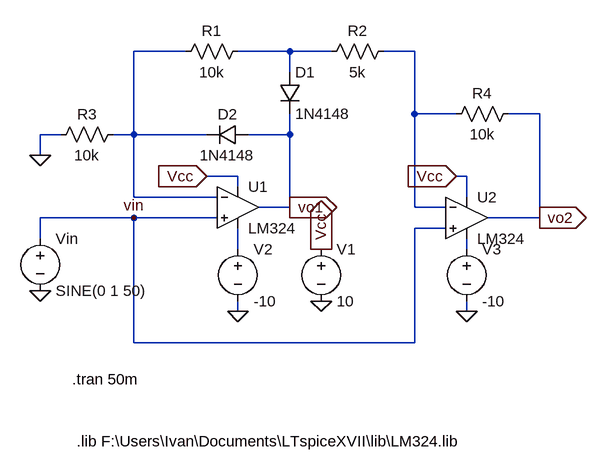
[diagram p0: schematic TP1_MORALES_SUAREZ_TORRES_C3.asc]
TP1_MORALES_SUAREZ_TORRES_C3.asc, the LTspice schematic file:
Version 4
SHEET 1 880 696
WIRE 160 80 80 80
WIRE 320 80 240 80
WIRE 384 80 320 80
WIRE 512 80 464 80
WIRE 320 112 320 80
WIRE 512 176 512 80
WIRE 576 176 512 176
WIRE 704 176 656 176
WIRE -32 208 -64 208
WIRE 80 208 80 80
WIRE 80 208 48 208
WIRE 192 208 80 208
WIRE 320 208 320 176
WIRE 320 208 256 208
WIRE -64 240 -64 208
WIRE 240 272 192 272
WIRE 592 272 576 272
WIRE 240 288 240 272
WIRE 80 304 80 208
WIRE 208 304 80 304
WIRE 592 304 592 272
WIRE 320 320 320 208
WIRE 320 320 272 320
WIRE 512 320 512 176
WIRE 560 320 512 320
WIRE 80 336 -64 336
WIRE 208 336 80 336
WIRE 704 336 704 176
WIRE 704 336 624 336
WIRE 560 352 512 352
WIRE -64 368 -64 336
WIRE 240 384 240 352
WIRE 592 384 592 368
WIRE 240 480 240 464
WIRE 592 480 592 464
WIRE 80 528 80 336
WIRE 512 528 512 352
WIRE 512 528 80 528
FLAG 240 480 0
FLAG 368 464 0
FLAG -64 240 0
FLAG 368 384 Vcc
IOPIN 368 384 Out
FLAG 192 272 Vcc
IOPIN 192 272 In
FLAG -64 448 0
FLAG 576 272 Vcc
IOPIN 576 272 In
FLAG 592 480 0
FLAG 704 336 vo2
IOPIN 704 336 Out
FLAG 80 336 vin
FLAG 320 320 vo1
IOPIN 320 320 Out
SYMBOL res 256 64 R90
WINDOW 0 0 56 VBottom 2
WINDOW 3 32 56 VTop 2
SYMATTR InstName R1
SYMATTR Value 10k
SYMBOL res 480 64 R90
WINDOW 0 0 56 VBottom 2
WINDOW 3 32 56 VTop 2
SYMATTR InstName R2
SYMATTR Value 5k
SYMBOL res 64 192 R90
WINDOW 0 0 56 VBottom 2
WINDOW 3 32 56 VTop 2
SYMATTR InstName R3
SYMATTR Value 10k
SYMBOL res 672 160 R90
WINDOW 0 0 56 VBottom 2
WINDOW 3 32 56 VTop 2
SYMATTR InstName R4
SYMATTR Value 10k
SYMBOL voltage 368 368 R0
WINDOW 123 0 0 Left 0
WINDOW 39 0 0 Left 0
SYMATTR InstName V1
SYMATTR Value 10
SYMBOL voltage 240 368 R0
WINDOW 123 0 0 Left 0
WINDOW 39 0 0 Left 0
SYMATTR InstName V2
SYMATTR Value -10
SYMBOL OpAmps\\LM324 240 320 R0
SYMATTR InstName U1
SYMBOL OpAmps\\LM324 592 336 R0
SYMATTR InstName U2
SYMBOL diode 304 112 R0
SYMATTR InstName D1
SYMATTR Value 1N4148
SYMBOL diode 256 192 R90
WINDOW 0 0 32 VBottom 2
WINDOW 3 32 32 VTop 2
SYMATTR InstName D2
SYMATTR Value 1N4148
SYMBOL voltage -64 352 R0
WINDOW 123 0 0 Left 0
WINDOW 39 0 0 Left 0
SYMATTR InstName Vin
SYMATTR Value SINE(0 1 50)
SYMBOL voltage 592 368 R0
WINDOW 123 0 0 Left 0
WINDOW 39 0 0 Left 0
SYMATTR InstName V3
SYMATTR Value -10
TEXT -8 680 Left 2 !.lib F:\\Users\\Ivan\\Documents\\LTspiceXVII\\lib\\LM324.lib
TEXT 88 584 Right 2 !.tran 50m

The netlist it stands for:
* TP1_MORALES_SUAREZ_TORRES_C3.asc
R1 N002 N001 10k
R2 N003 N002 5k
R3 N001 0 10k
R4 vo2 N003 10k
V1 Vcc 0 10
V2 N004 0 -10
* U1: LM324 (symbol OpAmps\LM324 not available, pins judged from their places): In+=vin In-=N001 V+=Vcc V-=N004 OUT=vo1
* U2: LM324 (symbol OpAmps\LM324 not available, pins judged from their places): In+=vin In-=N003 V+=Vcc V-=N005 OUT=vo2
D1 N002 vo1 1N4148
D2 vo1 N001 1N4148
Vin vin 0 SINE(0 1 50)
V3 N005 0 -10
.model D D
.lib standard.dio
.lib F:\Users\Ivan\Documents\LTspiceXVII\lib\LM324.lib
.tran 50m
.backanno
.end